# Altium schematic sheet BTL-TKHTN-Schematic.SchDoc
size A; SheetNumber: 1; SheetTotal: 1
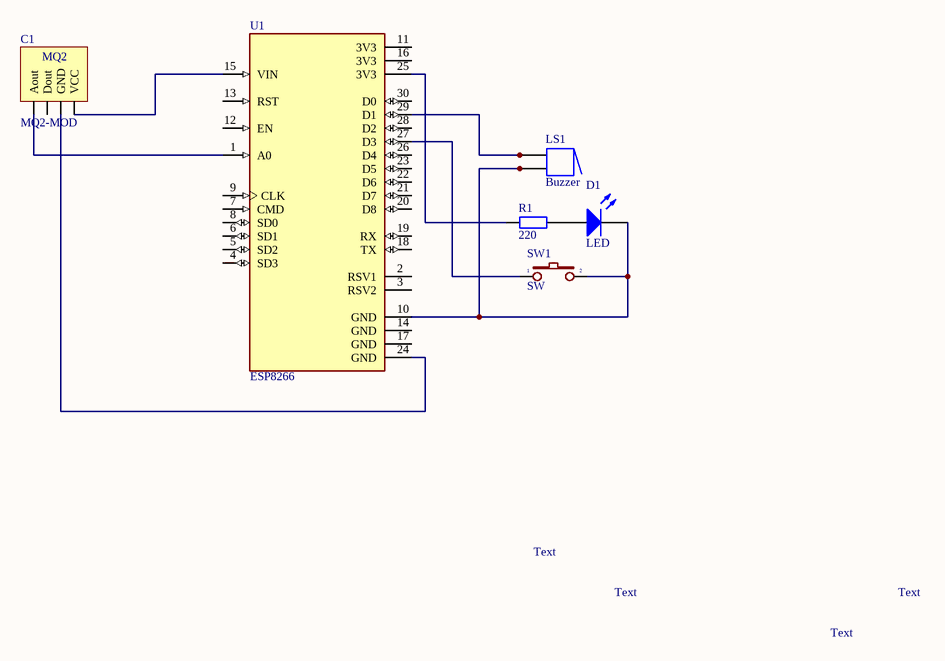
[diagram p0: BTL-TKHTN-Schematic.SchDoc]

## Parts
C1  MQ2-MOD  [MQ2-MODULE]
D1  LED  [LED_5mm]
LS1  Buzzer  [ABSM-1574]
R1  220  [RES-1/4W]
SW1  SW  [SW2]
U1  ESP8266  [MODULE_ZC563900]

## Nets
NetC1_1: C1.1(Aout) U1.1(A0)
NetC1_3: C1.3(GND) U1.24(GND)
NetC1_4: C1.4(VCC) U1.15(VIN)
NetD1_1: D1.1(A) R1.2
NetD1_2: D1.2(K) LS1.2 LS1.2A SW1.2 U1.10(GND)
NetLS1_1: LS1.1 LS1.1A U1.29(D1)
NetR1_1: R1.1 U1.25(3V3)
NetSW1_1: SW1.1 U1.27(D3)

Not connected (* = marked no-connect by the designer): C1 2(Dout); U1 2(RSV1) 3(RSV2) 4(SD3) 5(SD2) 6(SD1) 7(CMD) 8(SD0) 9(CLK) 11(3V3) 12(EN) 13(RST) 14(GND) 16(3V3) 17(GND) 18(TX) 19(RX) 20(D8) 21(D7) 22(D6) 23(D5) 26(D4) 28(D2) 30(D0)

## Notes on the sheet
- Text
- (in symbol MQ2-MOD) MQ2

## Library data of the parts
C1 = MQ2-MOD: Manufacturer: W¨¹rth Elektronik eiSos GmbH; partNo: 613004143121; ComponentLink1 Description: Manufacturer; ComponentLink2 Description: Datasheet; NoPins: 04; Created Date: 29 March 2013; ComponentLink1URL: http://www.we-online.com; ComponentLink2URL: http://katalog.we-online.de/em/datasheet/6130xx143121.pdf; Created by: Karrer Zheng
D1 = LED: Typical INFRARED GaAs LED; Published: 8-Jun-2000; LatestRevisionDate: 08-Jul-2005; LatestRevisionNote: Mech Layer 1 removed.; PackageReference: LED-0; Publisher: Altium Limited
LS1 = Buzzer: Magnetic Transducer Buzzer; Published: 24-Mar-1999; LatestRevisionDate: 17-Dec-2003; LatestRevisionNote: Schematic revised, PCB Footprint replaced.; DatasheetVersion: 17-Dec-2003; PackageReference: ABSM-1574; Publisher: Altium Limited; PackageDescription: Magnetic Transducer Buzzer; ComponentLink1Description: Manufacturer Link; ComponentLink1URL: http://www.megastar.com/linecard/buzzmode/index.php
R1 = R: Resistor R1/4W
SW1 = SW2: Switch button 2 pin; Value: SW chip 2 pin
U1 = ZC563900: NodeMcu Lua ESP8266 WIFI Internet of Things Network Development Module Board; MF: YKS; Value: *; SnapEDA_Link: https://www.snapeda.com/parts/ZC563900/YKS/view-part/?ref=snap; Availability: Not in stock; Price: None; Package: None; Check_prices: https://www.snapeda.com/parts/ZC563900/YKS/view-part/?ref=eda; MP: ZC563900